# EAGLE design North_Paw_V2p0 (EAGLE 6.5.0)
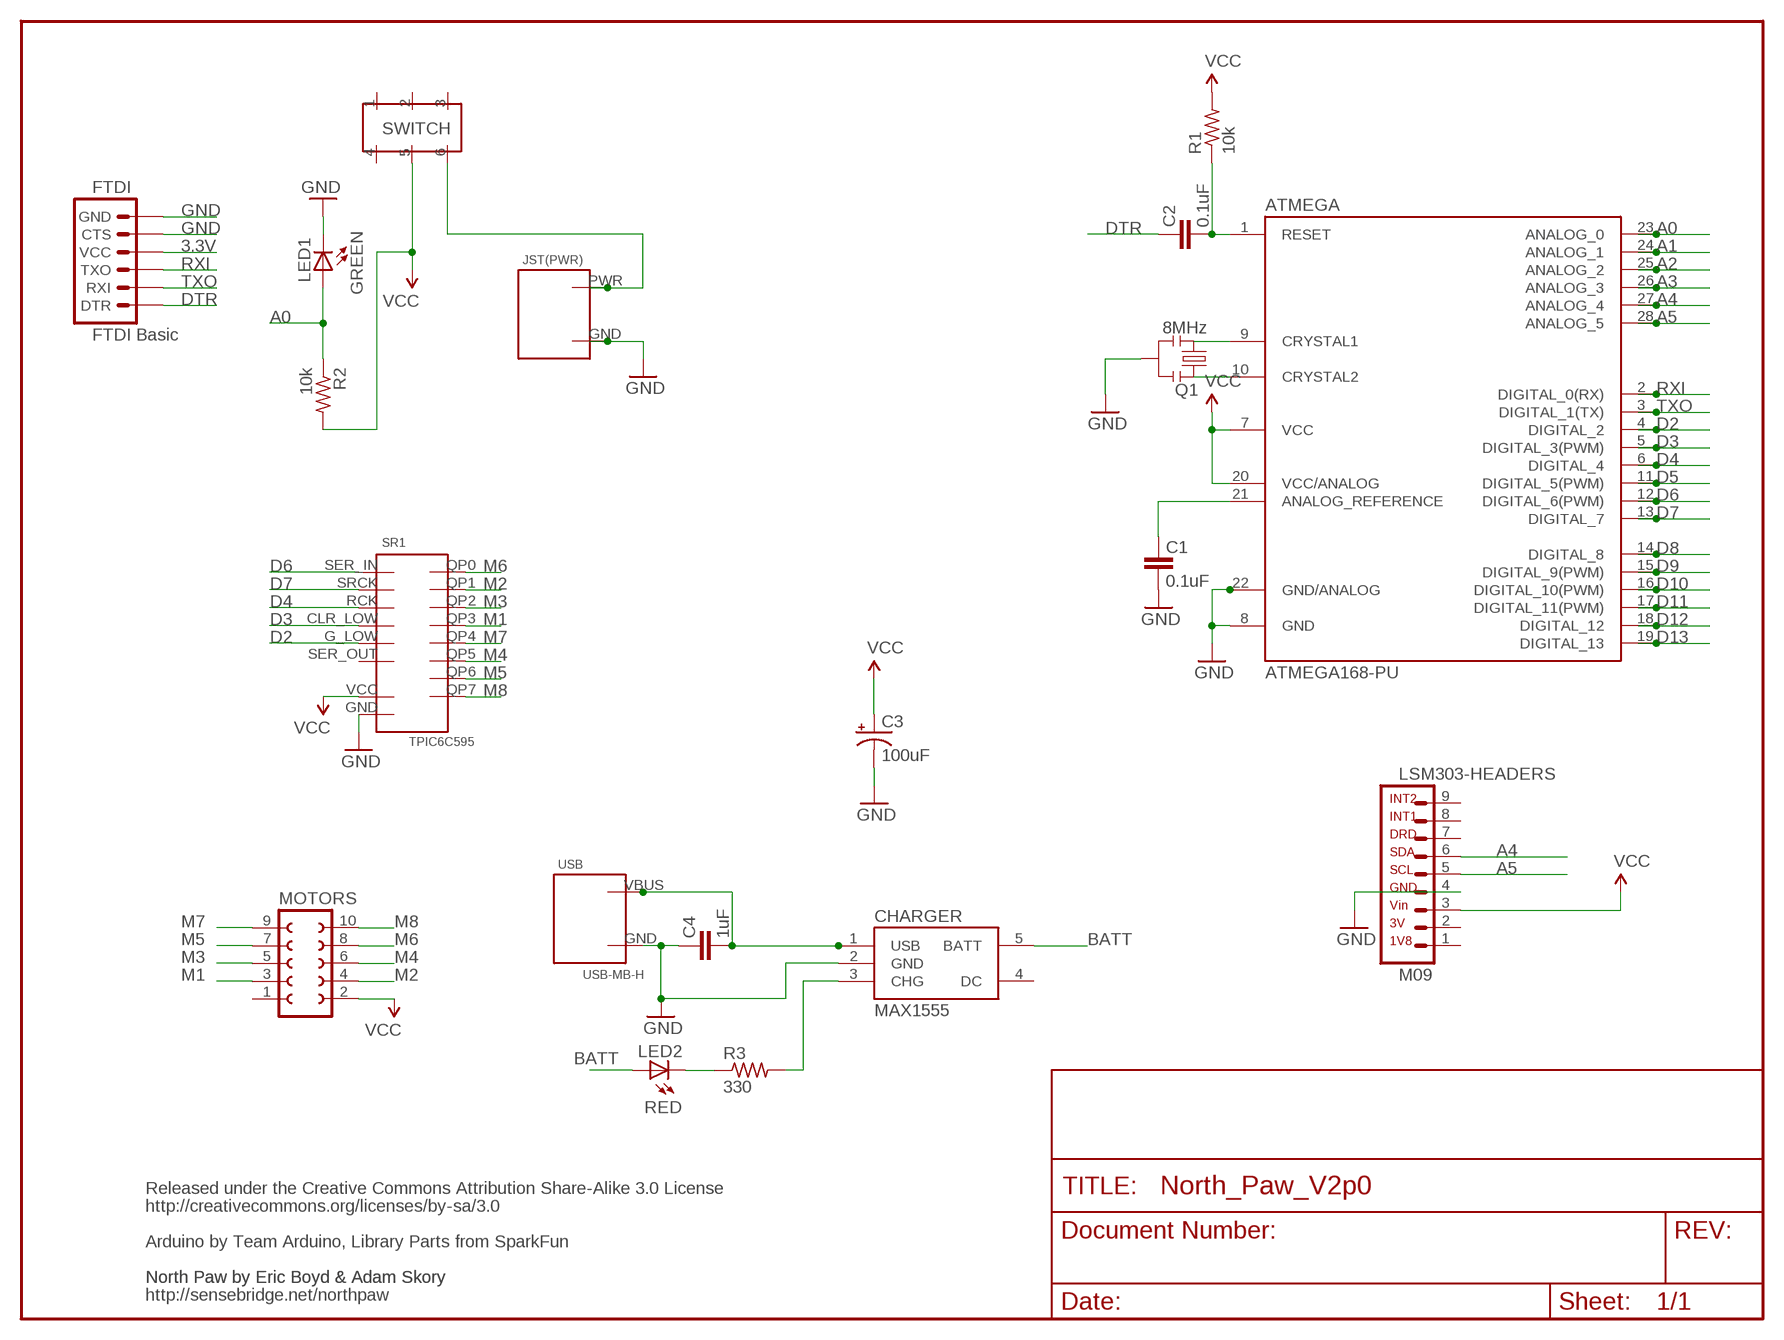
[diagram p0: schematic, sheet 1]

## Parts
ATMEGA  ATMEGA168-PU  [DIL28-3]
C1  0.1uF  CAPPTH  [CAP-PTH-SMALL]
C2  0.1uF  CAPPTH  [CAP-PTH-SMALL]
C3  100uF  CAP_POLPTH1  [CPOL-RADIAL-100UF-25V]
C4  1uF  CAPPTH  [CAP-PTH-SMALL]
CHARGER  MAX1555  [SOT23-5]
FTDI  FTDI Basic  ARDUINO_SERIAL_PROGRAMPTH  [1X06]
JST(PWR)  S2B-PH-K-S  [S4B-ZR]
LED1  GREEN  LED3MM  [LED3MM]
LED2  RED  LED3MM  [LED3MM]
LSM303-HEADERS  M09  MA09-1W  [MA09-1W]
MOTORS  FE05-2  [FE05-2]
Q1  8MHz  RESONATORPTH  [RESONATOR-PTH]
R1  10k  R-US_0204/5  [0204/5]
R2  10k  R-US_0204/7  [0204/7]
R3  330  R-US_0204/7  [0204/7]
SR1  TPIC6C595  [TPIC6C595]
SWITCH  OS202011MA0QS1  [OS202011MA0QS1]
USB  USB-MB-H  [USB-MB-H]

## Nets
3.3V [ground]: ATMEGA.7(VCC) ATMEGA.20(VCC/ANALOG) C3.1(+) FTDI.4(VCC) LSM303-HEADERS.3 MOTORS.2 R1.2 R2.2 SR1.VCC SWITCH.5 ; supply symbol labelled VCC
A0: ATMEGA.23(ANALOG_0) LED1.A R2.1
A1: ATMEGA.24(ANALOG_1)
A2: ATMEGA.25(ANALOG_2)
A3: ATMEGA.26(ANALOG_3)
A4: ATMEGA.27(ANALOG_4) LSM303-HEADERS.6
A5: ATMEGA.28(ANALOG_5) LSM303-HEADERS.5
BATT [power]: CHARGER.5(BATT) JST(PWR).PWR LED2.A SWITCH.6
D2: ATMEGA.4(DIGITAL_2) SR1.G_LOW
D3: ATMEGA.5(DIGITAL_3(PWM)) SR1.CLR_LOW
D4: ATMEGA.6(DIGITAL_4) SR1.RCK
D5: ATMEGA.11(DIGITAL_5(PWM))
D6: ATMEGA.12(DIGITAL_6(PWM)) SR1.SER_IN
D7: ATMEGA.13(DIGITAL_7) SR1.SRCK
D8: ATMEGA.14(DIGITAL_8)
D9: ATMEGA.15(DIGITAL_9(PWM))
D10: ATMEGA.16(DIGITAL_10(PWM))
D11: ATMEGA.17(DIGITAL_11(PWM))
D12: ATMEGA.18(DIGITAL_12)
D13: ATMEGA.19(DIGITAL_13)
DTR: C2.2 FTDI.1(DTR)
GND [ground]: ATMEGA.8(GND) ATMEGA.22(GND/ANALOG) C1.1 C3.2(-) C4.2 CHARGER.2(GND) FTDI.5(CTS) FTDI.6(GND) JST(PWR).GND LED1.K(C) LSM303-HEADERS.4 Q1.2 SR1.GND USB.GND
M1: MOTORS.3 SR1.QP3
M2: MOTORS.4 SR1.QP1
M3: MOTORS.5 SR1.QP2
M4: MOTORS.6 SR1.QP5
M5: MOTORS.7 SR1.QP6
M6: MOTORS.8 SR1.QP0
M7: MOTORS.9 SR1.QP4
M8: MOTORS.10 SR1.QP7
N$1: ATMEGA.9(CRYSTAL1) Q1.3
N$2: ATMEGA.10(CRYSTAL2) Q1.1
N$3: ATMEGA.21(ANALOG_REFERENCE) C1.2
N$7: CHARGER.3(CHG) R3.2
N$9: LED2.K(C) R3.1
RESET: ATMEGA.1(RESET) C2.1 R1.1
RXI: ATMEGA.2(DIGITAL_0(RX)) FTDI.3(TXO)
TXO: ATMEGA.3(DIGITAL_1(TX)) FTDI.2(RXI)
USB_VIN: C4.1 CHARGER.1(USB) USB.VBUS(PWR)
Unconnected: CHARGER.4(DC) LSM303-HEADERS.1 LSM303-HEADERS.2 LSM303-HEADERS.7 LSM303-HEADERS.8 LSM303-HEADERS.9 MOTORS.1 SR1.SER_OUT

## Notes on the sheet
- SWITCH
- Released under the Creative Commons Attribution Share-Alike 3.0 License
- http://creativecommons.org/licenses/by-sa/3.0
- Arduino by Team Arduino, Library Parts from SparkFun
- North Paw by Eric Boyd & Adam Skory | North Paw by Eric Boyd & Adam Skory
- http://sensebridge.net/northpaw

## Power pins joined to a net without a drawn wire
1: SWITCH.1
2: SWITCH.2
3: SWITCH.3
4: SWITCH.4

## Library data of the parts
ATMEGA = Arduino-AVR:ATMEGA168-PU
C1 C2 C4 = SparkFun:CAP: Capacitor Standard 0603 ceramic capacitor, and 0.1" leaded capacitor.
C3 = SparkFun:CAP_POL: Capacitor Polarized These are standard SMD and PTH capacitors. Normally 10uF, 47uF, and 100uF in electrolytic and tantalum varieties. Always verify the external diameter of the through hole cap, it varies with capacity, voltage, and manufacturer. The EIA devices should be standard.
CHARGER = SparkFun:MAX1555: MAX1555 Lithium Charger IC SOT-23 Lithium Polymer charging IC. Schematic element and footprint proven. Spark Fun Electronics SKU : COM-00674
FTDI = SparkFun:ARDUINO_SERIAL_PROGRAM
JST(PWR) = North_Paw:S2B-PH-K-S
LED1 LED2 = SparkFun:LED: LEDs Standard schematic elements and footprints for 5mm, 3mm, 1206, and 0603 sized LEDs. 5mm - Spark Fun Electronics SKU : COM-00529 (and others)
LSM303-HEADERS = North_Paw:MA09-1W: PIN HEADER
MOTORS = North_Paw:FE05-2: FEMALE HEADER
Q1 = SparkFun:RESONATOR: Resonator Small SMD resonator. This is the itty bitty 10/20MHz resonators with built in caps. CSTCE10M0G55 and CSTCE20M0V53. Footprint has been reviewed closely but hasn't been tested yet.
R1-R3 = resistor:R-US_: RESISTOR, American symbol
SR1 = North_Paw:TPIC6C595
SWITCH = OS202011MA0QS1:OS202011MA0QS1
USB = North_Paw:USB-MB-H

## Net classes
0 default: width 0.381 mm, clearance 0.381 mm
1 power: width 0.508 mm, clearance 0.381 mm
2 ground: width 0.508 mm, clearance 0.381 mm

## Board
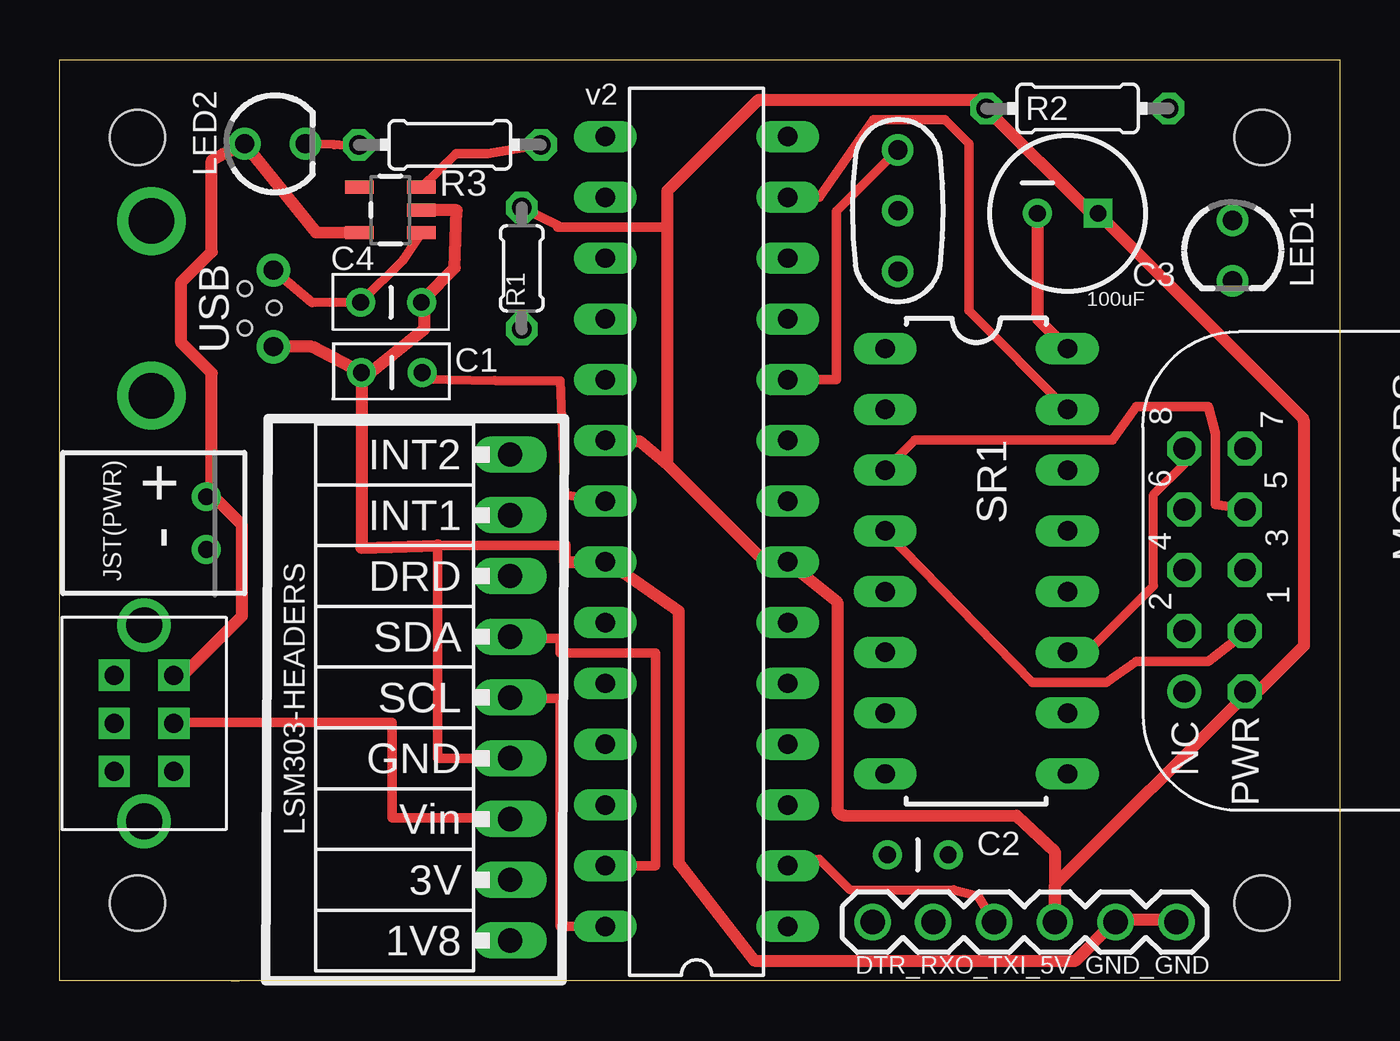
[diagram p1: board, top side]
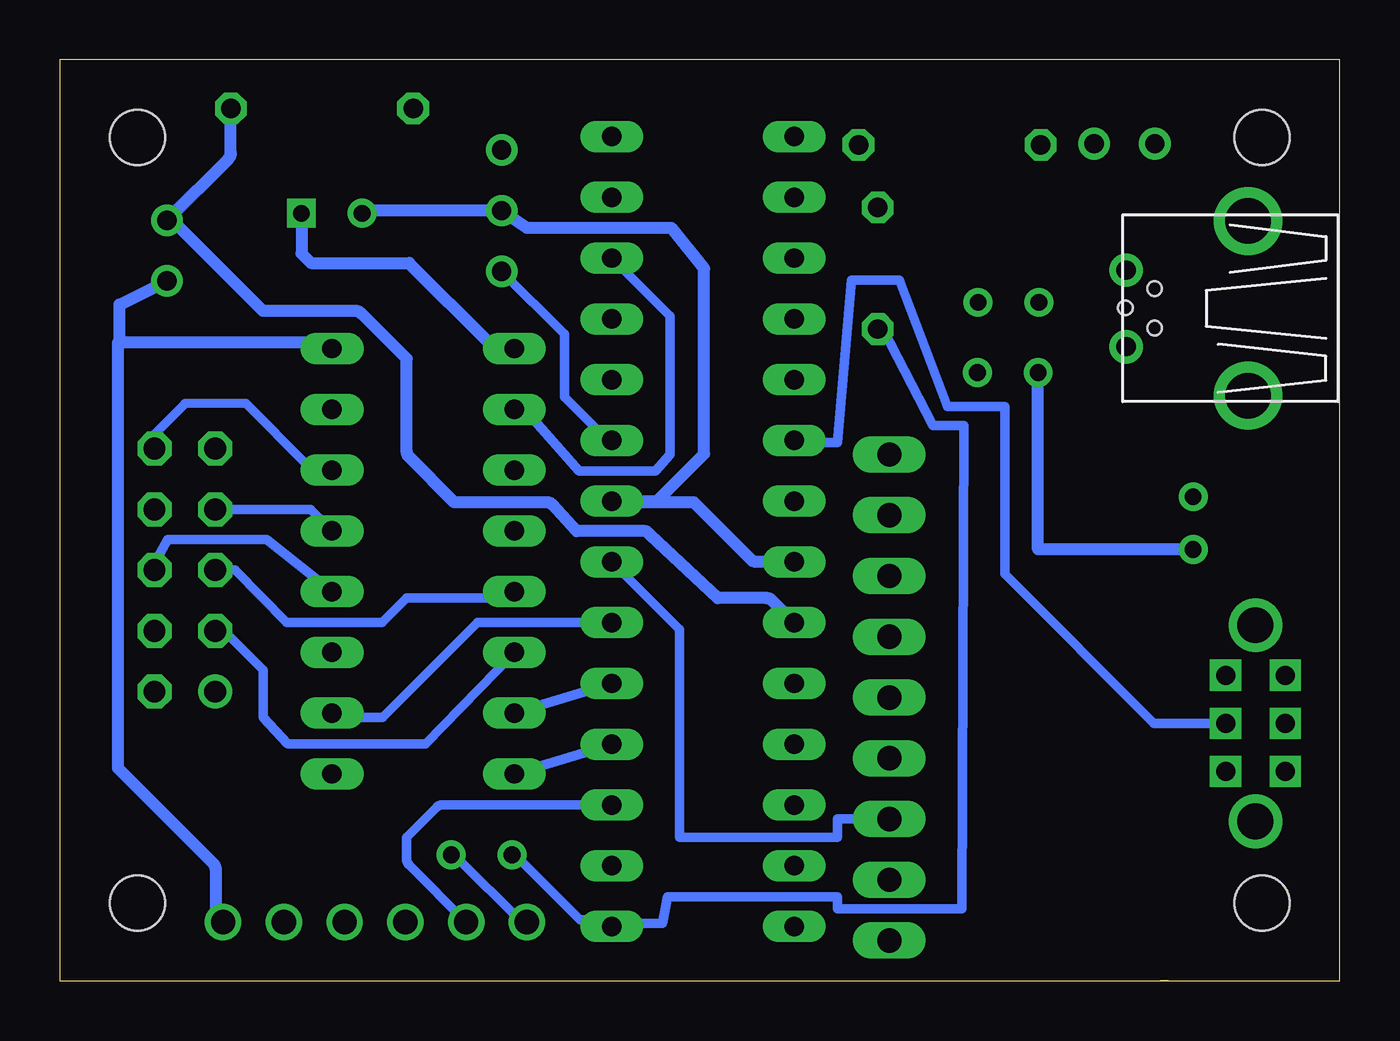
[diagram p2: board, bottom side, seen from below]

Size 53.5 x 38.5 mm. Coordinates in mm from the lower left corner, seen from the top.
Outline: 0,0 0,38.5 53.5,38.5 53.5,0 21,0 20.67,0.01 7.17,0.01 7.5,0 0,0
Copper layers (1*16): Top 0.035mm / dielectric 1.5mm / Bottom 0.035mm
Design rules "default *": minimum track width 8mil, minimum drill 24mil, track to track 8mil, track to pad 6mil, pad to pad 6mil, via to via 6mil, smd to smd 6mil, copper to edge 40mil, drill to drill 8mil, minimum pad ring 10mil, minimum via ring 8mil, stop-mask expansion 4mil, vias tented up to drill 0mil, thermal gap 10mil
Holes 2.3 mm at 3.25,3.25 3.25,35.25 50.25,35.25 50.25,3.25

### Footprints (pad centres in the part's own frame; a part is rotated, then mirrored left to right if it is on the bottom)
DIL28-3 = drill 0.813 long: 1 -16.51,-3.81; 2 -13.97,-3.81; 3 -11.43,-3.81; 4 -8.89,-3.81; 5 -6.35,-3.81; 6 -3.81,-3.81; 7 -1.27,-3.81; 8 1.27,-3.81; 9 3.81,-3.81; 10 6.35,-3.81; 11 8.89,-3.81; 12 11.43,-3.81; 13 13.97,-3.81; 14 16.51,-3.81; 15 16.51,3.81; 16 13.97,3.81; 17 11.43,3.81; 18 8.89,3.81; 19 6.35,3.81; 20 3.81,3.81; 21 1.27,3.81; 22 -1.27,3.81; 23 -3.81,3.81; 24 -6.35,3.81; 25 -8.89,3.81; 26 -11.43,3.81; 27 -13.97,3.81; 28 -16.51,3.81
CAP-PTH-SMALL = drill 0.7 round: 1 0,0; 2 2.54,0
CPOL-RADIAL-100UF-25V = drill 0.7 square: 1 1.27,0 | drill 0.7 round: 2 -1.27,0
SOT23-5 = smd 0.55 x 1.2: 1 -0.95,-1.3; 2 0,-1.3; 3 0.95,-1.3; 4 0.95,1.3; 5 -0.95,1.3
1X06 = drill 1.016 round: 1 0,0; 2 2.54,0; 3 5.08,0; 4 7.62,0; 5 10.16,0; 6 12.7,0
S4B-ZR = drill 0.7 pad 1.15 round: GND 1.1,0; PWR -1.1,0
LED3MM = drill 0.813 round: A -1.27,0; K 1.27,0
MA09-1W = drill 1.016 long: 1 -10.16,0; 2 -7.62,0; 3 -5.08,0; 4 -2.54,0; 5 0,0; 6 2.54,0; 7 5.08,0; 8 7.62,0; 9 10.16,0
FE05-2 = drill 0.914 round: 1 5.05,-6.27 | drill 0.914 octagon: 2 5.05,-3.73; 3 2.51,-6.27; 4 2.51,-3.73; 5 -0.03,-6.27; 6 -0.03,-3.73; 7 -2.57,-6.27; 8 -2.57,-3.73; 9 -5.11,-6.27; 10 -5.11,-3.73
RESONATOR-PTH = drill 0.8 round: 1 -2.54,0; 2 0,0; 3 2.54,0
0204/5 = drill 0.813 octagon: 1 -2.54,0; 2 2.54,0
0204/7 = drill 0.813 octagon: 1 -3.81,0; 2 3.81,0
TPIC6C595 = drill 0.813 long: CLR_LOW -3.81,-6.35; G_LOW -3.81,-8.89; GND 3.81,8.89; QP0 -3.81,3.81; QP1 -3.81,1.27; QP2 -3.81,-1.27; QP3 -3.81,-3.81; QP4 3.81,-3.81; QP5 3.81,-1.27; QP6 3.81,1.27; QP7 3.81,3.81; RCK 3.81,-6.35; SER_IN -3.81,6.35; SER_OUT 3.81,-8.89; SRCK 3.81,6.35; VCC -3.81,8.89
OS202011MA0QS1 = drill 0.8 pad 1.016 square: 1 -2.007,1.245; 2 0,1.245; 3 2.007,1.245; 4 -2.007,-1.245; 5 0,-1.245; 6 2.007,-1.245 | drill 1.499 pad 2.032 round: P$1 4.102,0; P$2 -4.102,0
USB-MB-H = drill 0.8 pad 1.397 round: GND 5.1,-1.6; VBUS 5.1,1.6 | drill 1.9 round: P$6 0,-3.65; P$7 0,3.65 | hole 0.6: 3.911,0.829; 5.13,0.023; 3.911,-0.829

### Placement (x,y rotation side)
ATMEGA  26.61,18.78 90 top
C1  12.61,25.43 0 top
C2  34.6,5.26 0 top
C3  42.13,32.08 0 top
C4  12.58,28.36 0 top
CHARGER  13.82,32.22 90 top
FTDI  33.97,2.45 0 top
JST(PWR)  6.13,19.13 270 top
LED1  49.02,30.52 270 top
LED2  9,34.99 0 top
LSM303-HEADERS  18.82,11.84 90 top
MOTORS  53.27,17.14 270 top
Q1  35.03,32.2 270 top
R1  19.31,29.78 90 top
R2  42.54,36.47 180 top
R3  16.3,34.95 0 top
SR1  38.31,17.54 0 top
SWITCH  3.52,10.76 90 top
USB  3.83,28.11 0 top

### Tracks (layer width: path | path; a pad name or v marks a point on that pad's centre or on a via)
3.3V
  Top 0.406: R1.2 20.8,31.59 20.8,31.5 25.4,31.5 25.4,31.6
  Top 0.508: 25.4,21.59 24.23,22.56 22.96,22.56 ATMEGA.20 | 25.4,21.59 29.21,17.78 ATMEGA.7 32.5,15.83 32.5,7.22 arc91 32.82,6.9 40,6.9 41.59,5.41 FTDI.4 | 25.4,21.59 25.4,31.6 25.4,33.02 29.21,36.83 38.37,36.83 R2.2 43.12,32.08 C3.1 51.91,23.57 arc-45 52,23.35 52,14 50.18,12.18 arc-45 49.95,12.09 MOTORS.2
  Bottom 0.406: ATMEGA.7 27.6,14.69 27.6,7 27.6,6.1 27.6,6 21,6 21,6.76 LSM303-HEADERS.3 | SWITCH.5 7.76,10.76 14,17 14,24 16.4,24 18.4,29.3 20.4,29.3 21,22.5 22.8,22.5 ATMEGA.20
  Bottom 0.508: 43.18,31.75 C3.1 43.4,30.4 43,30 38.89,30 35.56,26.67 SR1.VCC
A0
  Bottom 0.381: 44.45,28 44.45,27.94
  Bottom 0.508: ATMEGA.23 23.74,15.91 arc-45 23.97,16 26,16 28.81,18.61 arc-45 29.03,18.8 31.9,18.8 32.91,19.91 arc-45 33.13,20 37,20 38.91,21.91 arc45 39,22.13 39,26 40.91,27.91 arc-45 41.13,28 44.45,28 45,28 48.7,31.7 arc-45 48.92,31.79 LED1.A 46.44,34.37 arc-45 46.35,34.6 R2.1
A4
  Top 0.406: ATMEGA.27 24.9,4.81 24.9,13.7 20.9,13.7 20.9,14.3 18.82,14.3 LSM303-HEADERS.6
A5
  Top 0.406: ATMEGA.28 20.9,2.27 20.9,11.8 18.82,11.8 LSM303-HEADERS.5
BATT
  Top 0.508: 6.35,20.32 7.62,19.05 7.62,15.24 5.08,12.7 SWITCH.6 | 6.35,20.32 6.35,25.4 5.08,26.67 5.08,29.21 6.35,30.48 6.35,34.29 6.82,34.56 LED2.A 10.71,31.29 CHARGER.5 | 6.35,20.32 JST(PWR).PWR
D2
  Bottom 0.406: ATMEGA.4 SR1.G_LOW
D3
  Bottom 0.406: ATMEGA.5 SR1.CLR_LOW
D4
  Bottom 0.406: ATMEGA.6 36.03,14.97 40,11 41.93,11 SR1.RCK
D6
  Bottom 0.406: SR1.SER_IN 34,23.8 31.8,21.3 28.6,21.3 28,22 28,27.79 ATMEGA.12
D7
  Top 0.406: ATMEGA.13 31.75,32.75 34,36 37,36 38,35 38,28.01 SR1.SRCK
DTR
  Bottom 0.381: C2.2 36.83,5.08 34.29,2.54 FTDI.1
GND
  Top 0.406: 21.1,18.2 15.8,18.2 15.8,9.3 LSM303-HEADERS.4
  Top 0.508: 15.24,28.52 16.51,29.79 16.59,32.2 15.32,32.2 CHARGER.2 | 15.24,28.52 15.24,27.25 12.66,25.16 C1.1 | 15.24,28.52 C4.2 | USB.GND 10.54,26.51 C1.1 | FTDI.5 44.45,2.54 46.99,2.54 FTDI.6 | C3.2 40.86,27.82 arc45 40.95,27.59 SR1.GND | ATMEGA.22 21.1,17.51 21.1,18.2 | 15.8,18.2 12.61,18.1 C1.1
  Bottom 0.508: SR1.GND 43.18,26.67 51,26.67 | 51,26.67 51.07,26.67 51.07,8.89 47.08,4.9 arc45 46.99,4.68 46.99,2.54 FTDI.6 | C3.2 40.75,32.2 Q1.2 33.97,31.47 27.94,31.47 26.57,29.77 26.57,22.02 28.54,20.05 ATMEGA.8 arc-45 30.31,20 27,20 24.6,17.6 arc-45 24.38,17.51 ATMEGA.22 | LED1.K 51,28.28 51,26.67 | JST(PWR).GND 12.61,18.03 C1.1
M1
  Bottom 0.406: SR1.QP3 38.2,9.9 43.98,9.9 45,11 45,13 46.63,14.63 MOTORS.3
M2
  Top 0.406: SR1.QP1 40.66,12.48 43.75,12.48 45,13.35 48,13.35 49.54,14.54 MOTORS.4
M3
  Bottom 0.406: SR1.QP2 34.77,16 39,16 40.02,14.97 44.02,14.97 46.17,17.17 MOTORS.5
M4
  Bottom 0.406: SR1.QP5 44.85,18.45 49,18.45 49.54,17.46 MOTORS.6
M5
  Bottom 0.406: SR1.QP6 43.02,19.71 MOTORS.7
M6
  Top 0.406: MOTORS.8 49.71,19.71 48.3,19.9 48.3,22.9 48,24 45,24 44,22.6 35.75,22.6 SR1.QP0
M7
  Top 0.381: SR1.QP4 43.18,13.97 45.72,16.51 45.72,20.32 46.99,21.59 MOTORS.9
M8
  Bottom 0.381: SR1.QP7 43.18,21.59 45.72,24.13 48.26,24.13 49.53,22.86 MOTORS.10
N$1
  Bottom 0.406: ATMEGA.9 30.59,22.59 32.4,24.4 32.4,27.03 Q1.3
N$2
  Top 0.406: ATMEGA.10 32.46,25.13 32.46,32.17 Q1.1
N$3
  Top 0.381: C1.2 15.2,25.16 18.19,25.09 20.92,25.09 21.09,20.32 ATMEGA.21
N$4
  Top 0.508: 41.6,2.4 41.6,4.01 49.63,12.04
N$5
  Top 0.406: 19,6.8 13.9,6.8 13.9,10.8 4.8,10.8
N$6
  Top 0.508: 44.12,2.41 44.04,2.41 42.47,0.84 29.03,0.84 25.87,4.9 25.87,15.44 22.91,17.5
N$7
  Top 0.406: R3.2 17.88,34.58 16.57,34.57 15.13,33.18 CHARGER.3
N$9
  Top 0.381: LED2.K 11.48,34.95 12.35,34.86 R3.1
RESET
  Bottom 0.381: C2.1 34.29,5.08 31.75,2.54 30.48,2.54 ATMEGA.1
  Bottom 0.406: R1.1 19.1,27.24 17,23.2 15.7,23.2 15.8,3 21,3 21,3.5 28.1,3.5 28.3,2.4 30.62,2.4 ATMEGA.1
RXI
  Top 0.381: ATMEGA.2 30.48,5.08 31.75,5.08 33.02,3.81 37.37,3.81 38.37,3.54 FTDI.3
TXO
  Bottom 0.406: ATMEGA.3 37.52,7.35 arc-45 37.74,7.25 39,6 39,5.07 arc-45 38.91,4.84 FTDI.2
USB_VIN
  Top 0.406: CHARGER.1 14.36,30.13 C4.1 10.54,28.36 USB.VBUS

### Text on the board
tPlace: DTR_RXO_TXI_5V_GND_GND
tNames: v2
tValues: RES 8Mhz | <-Off On->
200bmp: X:/Dropbox/Sensebridge/eagle/bmps/North_Paw_JUST_NP.bmp